# Altium project 2026MM.PrjPcb (part 9 of 10)
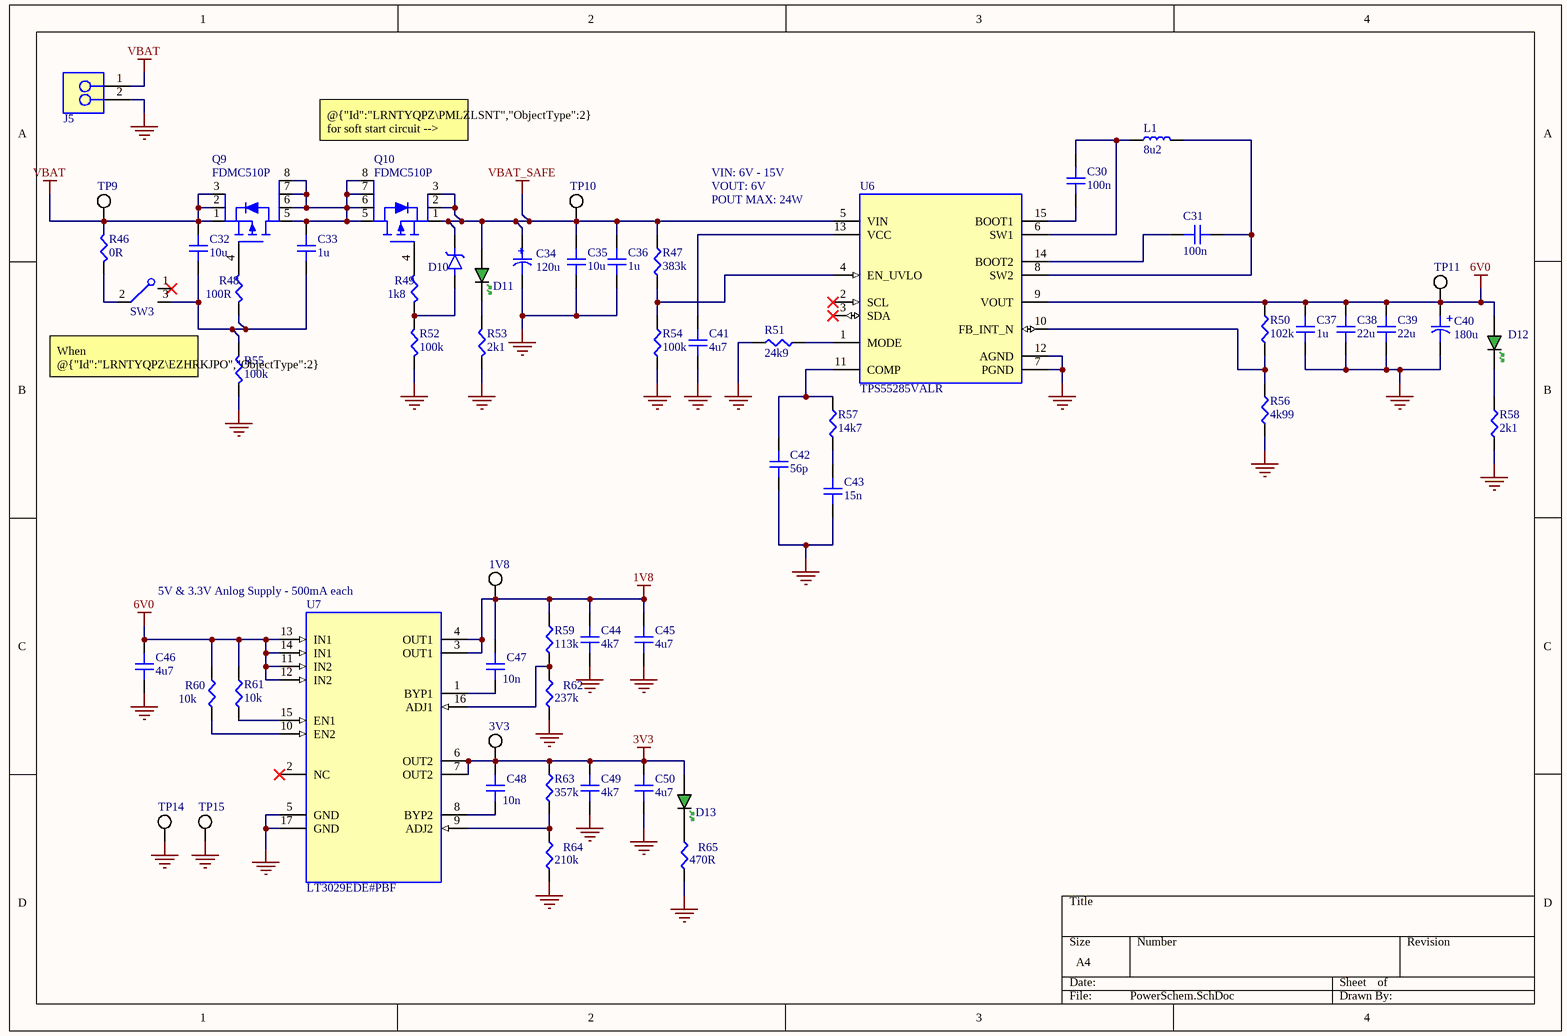
[diagram p9: PowerSchem.SchDoc]

## Sheet PowerSchem.SchDoc (continued)

### Library data of the parts (continued)
R52 = RES: Yageo RC0603FR-07100KL resistor 100k ohm 0603 1% thick film surface mount; Manufacturer: Bourns; Manufacturer Part Number: CR0603-FX-1003ELF; Value: 0; Max Power Dissipation: 100mW; Temperature Coefficient: 100ppm/°C; Voltage Rating: 75V; Voltage Rating (DC): 50V; Supplier: Avnet; Supplier Part Number: 61J5337; RoHS: Compliant; Category: Chip SMD Resistors; Stock: 2610; Pricing: 1=0.1, 25=0.012, 50=0.009, 100=0.006, 500=0.005 (USD); Case/Package: 0603; Case Code (Imperial): 0603; Case Code (Metric): 1608; China RoHS: Non-Compliant; Composition: Thick Film; Contact Plating: Tin; Depth: 800µm; Features: Moisture Resistant; Height: 450µm; Lifecycle Status: Production; Max Operating Temperature: 155°C; Military Standard: Not; Min Operating Temperature: -55°C; Mounting Technology: Surface Mount; Pins: 2; Number of Terminals: 2; Number of Terminations: 2; Packaging: Cut Tape; Power Dissipation: 100mW; Power Rating: 100mW; Radiation Hardening: No; REACH SVHC: Yes; Schedule B: 8533210045, 8533210045|8533210045|8533210045|8533210045|8533210045|8533210045|8533210045|8533210045|8533210045|8533210045|8533210045|8533210045|8533210045|8533210045|8533210045|8533210045|8533210045|8533210045|8533210045|8533210045|8533210045|8533210045|8533210045|85; Termination: SMD/SMT; Tolerance: 1%; Width: 800µm; Working Voltage: 75V; ComponentLink1URL: https://datasheet.octopart.com:443/CR0603-FX-1003ELF-Bourns-datasheet-159578630.pdf?src-supplier=ODG+(Origin+Data+Global); ComponentLink1Description: https://datasheet.octopart.com:443/CR0603-FX-1003ELF-Bourns-datasheet-159578630.pdf?src-supplier=ODG+(Origin+Data+Global); ComponentLink2URL: https://datasheet.octopart.com:443/CR0603-FX-1003ELF-Bourns-datasheet-181955239.pdf?src-supplier=IHS; ComponentLink2Description: https://datasheet.octopart.com:443/CR0603-FX-1003ELF-Bourns-datasheet-181955239.pdf?src-supplier=IHS; ComponentLink3URL: https://datasheet.octopart.com:443/CR0603-FX-1003ELF-Bourns-datasheet-68301634.pdf?src-supplier=Farnell; ComponentLink3Description: https://datasheet.octopart.com:443/CR0603-FX-1003ELF-Bourns-datasheet-68301634.pdf?src-supplier=Farnell; ComponentLink4URL: https://datasheet.octopart.com:443/CR0603-FX-1003ELF-Bourns-datasheet-24895818.pdf?src-supplier=Farnell; ComponentLink4Description: https://datasheet.octopart.com:443/CR0603-FX-1003ELF-Bourns-datasheet-24895818.pdf?src-supplier=Farnell; ComponentLink5URL: https://datasheet.octopart.com:443/CR0603-FX-1003ELF-Bourns-datasheet-22971629.pdf?src-supplier=Farnell; ComponentLink5Description: https://datasheet.octopart.com:443/CR0603-FX-1003ELF-Bourns-datasheet-22971629.pdf?src-supplier=Farnell; ComponentLink6URL: https://datasheet.octopart.com/CR0603-FX-1003ELF-Bourns-datasheet-5318152.pdf; ComponentLink6Description: https://datasheet.octopart.com/CR0603-FX-1003ELF-Bourns-datasheet-5318152.pdf; ComponentLink7URL: https://datasheet.octopart.com:443/CR0603-FX-1003ELF-Bourns-datasheet-154729663.pdf?src-supplier=Electro+Sonic; ComponentLink7Description: https://datasheet.octopart.com:443/CR0603-FX-1003ELF-Bourns-datasheet-154729663.pdf?src-supplier=Electro+Sonic; ComponentLink8URL: https://datasheet.octopart.com:443/CR0603-FX-1003ELF-Bourns-datasheet-34229249.pdf?src-supplier=Electro+Sonic; ComponentLink8Description: https://datasheet.octopart.com:443/CR0603-FX-1003ELF-Bourns-datasheet-34229249.pdf?src-supplier=Electro+Sonic; ComponentLink9URL: https://datasheet.octopart.com:443/CR0603-FX-1003ELF-Bourns-datasheet-11547086.pdf?src-supplier=Electro+Sonic; ComponentLink9Description: https://datasheet.octopart.com:443/CR0603-FX-1003ELF-Bourns-datasheet-11547086.pdf?src-supplier=Electro+Sonic; ComponentLink10URL: https://datasheet.octopart.com:443/CR0603-FX-1003ELF-Bourns-datasheet-49799764.pdf?src-supplier=element14+APAC; ComponentLink10Description: https://datasheet.octopart.com:443/CR0603-FX-1003ELF-Bourns-datasheet-49799764.pdf?src-supplier=element14+APAC; ComponentLink11URL: https://datasheet.octopart.com:443/CR0603-FX-1003ELF.-Bourns-datasheet-62114779.pdf?src-supplier=element14+APAC; ComponentLink11Description: https://datasheet.octopart.com:443/CR0603-FX-1003ELF.-Bourns-datasheet-62114779.pdf?src-supplier=element14+APAC; ComponentLink12URL: https://datasheet.octopart.com:443/CR0603-FX-1003ELF.-Bourns-datasheet-45190937.pdf?src-supplier=element14+APAC; ComponentLink12Description: https://datasheet.octopart.com:443/CR0603-FX-1003ELF.-Bourns-datasheet-45190937.pdf?src-supplier=element14+APAC; ComponentLink13URL: https://datasheet.octopart.com:443/CR0603-FX-1003ELF-Bourns-datasheet-28808732.pdf?src-supplier=element14+APAC; ComponentLink13Description: https://datasheet.octopart.com:443/CR0603-FX-1003ELF-Bourns-datasheet-28808732.pdf?src-supplier=element14+APAC; ComponentLink14URL: https://datasheet.octopart.com:443/CR0603-FX-1003ELF-Bourns-datasheet-140567134.pdf?src-supplier=Arrow.cn; ComponentLink14Description: https://datasheet.octopart.com:443/CR0603-FX-1003ELF-Bourns-datasheet-140567134.pdf?src-supplier=Arrow.cn; ComponentLink15URL: https://datasheet.octopart.com:443/CR0603-FX-1003ELF-Bourns-datasheet-7836176.pdf?src-supplier=Jameco; ComponentLink15Description: https://datasheet.octopart.com:443/CR0603-FX-1003ELF-Bourns-datasheet-7836176.pdf?src-supplier=Jameco; ComponentLink16URL: https://datasheet.octopart.com:443/CR0603-FX-1003ELF-Bourns-datasheet-1361.pdf?src-supplier=Newark; ComponentLink16Description: https://datasheet.octopart.com:443/CR0603-FX-1003ELF-Bourns-datasheet-1361.pdf?src-supplier=Newark; ComponentLink17URL: http://sigma.octopart.com:80/conflict_mineral_statement/Bourns-company-36.pdf?src-supplier=Compliance+Statements; ComponentLink17Description: http://sigma.octopart.com:80/conflict_mineral_statement/Bourns-company-36.pdf?src-supplier=Compliance+Statements; Supplier 1: Avnet; Supplier Part Number 1: RC0603FR-07100KL; Country of Origin: Mainland China, Taiwan; Export Control Classification Number (ECCN) Code: EAR99; Harmonized Tariff Schedule (HTS) Code: 8533.21.00.30; Introduction Date: 2004-09-22; Lead Free: Lead Free; Length: 1.6mm; ComponentLink18URL: https://datasheet.octopart.com:443/RC0603FR-07100KL-Yageo-datasheet-175887523.pdf?src-supplier=Newark; ComponentLink18Description: https://datasheet.octopart.com:443/RC0603FR-07100KL-Yageo-datasheet-175887523.pdf?src-supplier=Newark; ComponentLink19URL: https://datasheet.octopart.com:443/RC0603FR-07100KL-Yageo-datasheet-12596169.pdf?src-supplier=Newark; ComponentLink19Description: https://datasheet.octopart.com:443/RC0603FR-07100KL-Yageo-datasheet-12596169.pdf?src-supplier=Newark; ComponentLink20URL: https://datasheet.octopart.com:443/RC0603FR-07100KL-Yageo-datasheet-34211833.pdf?src-supplier=Newark; ComponentLink20Description: https://datasheet.octopart.com:443/RC0603FR-07100KL-Yageo-datasheet-34211833.pdf?src-supplier=Newark; ComponentLink21URL: https://datasheet.octopart.com:443/RC0603FR-07100KL-Yageo-datasheet-8328172.pdf?src-supplier=element14+APAC; ComponentLink21Description: https://datasheet.octopart.com:443/RC0603FR-07100KL-Yageo-datasheet-8328172.pdf?src-supplier=element14+APAC; ComponentLink22URL: https://datasheet.octopart.com:443/RC0603FR-07100KL-Yageo-datasheet-17842380.pdf?src-supplier=element14+APAC; ComponentLink22Description: https://datasheet.octopart.com:443/RC0603FR-07100KL-Yageo-datasheet-17842380.pdf?src-supplier=element14+APAC; ComponentLink23URL: https://datasheet.octopart.com:443/RC0603FR-07100KL-Yageo-datasheet-141265859.pdf?src-supplier=Upverter; ComponentLink23Description: https://datasheet.octopart.com:443/RC0603FR-07100KL-Yageo-datasheet-141265859.pdf?src-supplier=Upverter; ComponentLink24URL: https://datasheet.octopart.com:443/RC0603FR-07100KL-Yageo-datasheet-103092701.pdf?src-supplier=Upverter; ComponentLink24Description: https://datasheet.octopart.com:443/RC0603FR-07100KL-Yageo-datasheet-103092701.pdf?src-supplier=Upverter; ComponentLink25URL: https://sigma.octopart.com:443/138820526/technical_drawing/Yageo-RC0603FR-07100KL.pdf?src-supplier=Upverter; ComponentLink25Description: https://sigma.octopart.com:443/138820526/technical_drawing/Yageo-RC0603FR-07100KL.pdf?src-supplier=Upverter; ComponentLink26URL: https://datasheet.octopart.com:443/RC0603FR-07100KL-Yageo-datasheet-98239111.pdf?src-supplier=Upverter; ComponentLink26Description: https://datasheet.octopart.com:443/RC0603FR-07100KL-Yageo-datasheet-98239111.pdf?src-supplier=Upverter; ComponentLink27URL: https://datasheet.octopart.com:443/RC0603FR-07100KL-Yageo-datasheet-62067350.pdf?src-supplier=Farnell; ComponentLink27Description: https://datasheet.octopart.com:443/RC0603FR-07100KL-Yageo-datasheet-62067350.pdf?src-supplier=Farnell; ComponentLink28URL: https://datasheet.octopart.com:443/RC0603FR-07100KL-Yageo-datasheet-13691069.pdf?src-supplier=Farnell; ComponentLink28Description: https://datasheet.octopart.com:443/RC0603FR-07100KL-Yageo-datasheet-13691069.pdf?src-supplier=Farnell; ComponentLink29URL: https://datasheet.octopart.com:443/RC0603FR-07100KL-Yageo-Group-datasheet-176638170.pdf?src-supplier=Future+Electronics; ComponentLink29Description: https://datasheet.octopart.com:443/RC0603FR-07100KL-Yageo-Group-datasheet-176638170.pdf?src-supplier=Future+Electronics; ComponentLink30URL: https://datasheet.octopart.com:443/RC0603FR-07100KL-Yageo-datasheet-164759695.pdf?src-supplier=Future+Electronics; ComponentLink30Description: https://datasheet.octopart.com:443/RC0603FR-07100KL-Yageo-datasheet-164759695.pdf?src-supplier=Future+Electronics; ComponentLink31URL: https://datasheet.octopart.com:443/RC0603FR-07100KL-Yageo-datasheet-137700087.pdf?src-supplier=Future+Electronics; ComponentLink31Description: https://datasheet.octopart.com:443/RC0603FR-07100KL-Yageo-datasheet-137700087.pdf?src-supplier=Future+Electronics; ComponentLink32URL: https://datasheet.octopart.com:443/RC0603FR-07100KL-Yageo-datasheet-27584510.pdf?src-supplier=Future+Electronics; ComponentLink32Description: https://datasheet.octopart.com:443/RC0603FR-07100KL-Yageo-datasheet-27584510.pdf?src-supplier=Future+Electronics; ComponentLink33URL: https://datasheet.octopart.com:443/RC0603FR-07100KL-Yageo-datasheet-15599030.pdf?src-supplier=Future+Electronics; ComponentLink33Description: https://datasheet.octopart.com:443/RC0603FR-07100KL-Yageo-datasheet-15599030.pdf?src-supplier=Future+Electronics; ComponentLink34URL: https://datasheet.octopart.com:443/RC0603FR-07100KL-Yageo-datasheet-8324193.pdf?src-supplier=Future+Electronics; ComponentLink34Description: https://datasheet.octopart.com:443/RC0603FR-07100KL-Yageo-datasheet-8324193.pdf?src-supplier=Future+Electronics; ComponentLink35URL: https://datasheet.octopart.com:443/RC0603FR-07100KL-Yageo-datasheet-79472498.pdf?src-supplier=Megastar; ComponentLink35Description: https://datasheet.octopart.com:443/RC0603FR-07100KL-Yageo-datasheet-79472498.pdf?src-supplier=Megastar; ComponentLink36URL: https://datasheet.octopart.com/RC0603FR-07100KL-Yageo-datasheet-73766026.pdf; ComponentLink36Description: https://datasheet.octopart.com/RC0603FR-07100KL-Yageo-datasheet-73766026.pdf; ComponentLink37URL: https://datasheet.octopart.com:443/RC0603FR-07100KL-Yageo-datasheet-30459151.pdf?src-supplier=Seeed+Studio; ComponentLink37Description: https://datasheet.octopart.com:443/RC0603FR-07100KL-Yageo-datasheet-30459151.pdf?src-supplier=Seeed+Studio; ComponentLink38URL: https://datasheet.octopart.com:443/RC0603FR-07100KL-Yageo-datasheet-118562.pdf?src-supplier=DigiKey; ComponentLink38Description: https://datasheet.octopart.com:443/RC0603FR-07100KL-Yageo-datasheet-118562.pdf?src-supplier=DigiKey; ComponentLink39URL: https://datasheet.octopart.com:443/RC0603FR-07100KL-Yageo-datasheet-503470.pdf?src-supplier=element14; ComponentLink39Description: https://datasheet.octopart.com:443/RC0603FR-07100KL-Yageo-datasheet-503470.pdf?src-supplier=element14; ComponentLink40URL: http://sigma.octopart.com:80/conflict_mineral_statement/Yageo-company-3.pdf?src-supplier=Compliance+Statements; ComponentLink40Description: http://sigma.octopart.com:80/conflict_mineral_statement/Yageo-company-3.pdf?src-supplier=Compliance+Statements; ComponentLink41URL: http://sigma.octopart.com:80/rohs_statement/Yageo-company-2.pdf?src-supplier=Compliance+Statements; ComponentLink41Description: http://sigma.octopart.com:80/rohs_statement/Yageo-company-2.pdf?src-supplier=Compliance+Statements
R53 R58 = RES: Res Thick Film 0603 2.1K Ohm 1% 0.1W(1/10W) ±100ppm/C Pad SMD T/R; Manufacturer: Yageo Group; Manufacturer Part Number: RC0603FR-072K1L; Max Power Dissipation: 100mW; Temperature Coefficient: 100ppm/°C; Voltage Rating: 75V; Voltage Rating (DC): 50V; Value: 2k1; Supplier 1: Avnet; Supplier Part Number 1: 49AK1916; RoHS: Compliant; Category: Chip SMD Resistors; Stock: 3524; Pricing: 1=0.103, 25=0.006 (USD); Case/Package: 0603; Case Code (Imperial): 0603; China RoHS: Non-Compliant; Composition: Thick Film; Contact Plating: Tin; Depth: 800µm; Features: Moisture Resistant; Height: 450µm; Lead Free: Lead Free; Length: 1.6mm; Lifecycle Status: Production; Max Operating Temperature: 155°C; Military Standard: Not; Min Operating Temperature: -55°C; Mounting Technology: Surface Mount; Number of Terminals: 2; Number of Terminations: 2; Power Rating: 100mW; Radiation Hardening: No; REACH SVHC: Yes; Schedule B: 8533210045, 8533210045|8533210045, 8533210045|8533210045|8533210045, 8533210045|8533210045|8533210045|8533210045; Termination: SMD/SMT; Tolerance: 1%; Width: 800µm; Working Voltage: 75V; ComponentLink1URL: https://datasheet.octopart.com:443/RC0603FR-072K1L-Yageo-datasheet-175887523.pdf?src-supplier=Newark; ComponentLink1Description: https://datasheet.octopart.com:443/RC0603FR-072K1L-Yageo-datasheet-175887523.pdf?src-supplier=Newark; ComponentLink2URL: https://datasheet.octopart.com:443/RC0603FR-072K1L-Yageo-datasheet-103092701.pdf?src-supplier=Upverter; ComponentLink2Description: https://datasheet.octopart.com:443/RC0603FR-072K1L-Yageo-datasheet-103092701.pdf?src-supplier=Upverter; ComponentLink3URL: https://datasheet.octopart.com:443/RC0603FR-072K1L-Yageo-Group-datasheet-176638170.pdf?src-supplier=Future+Electronics; ComponentLink3Description: https://datasheet.octopart.com:443/RC0603FR-072K1L-Yageo-Group-datasheet-176638170.pdf?src-supplier=Future+Electronics; ComponentLink4URL: https://datasheet.octopart.com:443/RC0603FR-072K1L-Yageo-datasheet-164759695.pdf?src-supplier=Future+Electronics; ComponentLink4Description: https://datasheet.octopart.com:443/RC0603FR-072K1L-Yageo-datasheet-164759695.pdf?src-supplier=Future+Electronics; ComponentLink5URL: https://datasheet.octopart.com:443/RC0603FR-072K1L-Yageo-datasheet-127823281.pdf?src-supplier=Future+Electronics; ComponentLink5Description: https://datasheet.octopart.com:443/RC0603FR-072K1L-Yageo-datasheet-127823281.pdf?src-supplier=Future+Electronics; ComponentLink6URL: https://datasheet.octopart.com:443/RC0603FR-072K1L-Yageo-datasheet-137700087.pdf?src-supplier=Future+Electronics; ComponentLink6Description: https://datasheet.octopart.com:443/RC0603FR-072K1L-Yageo-datasheet-137700087.pdf?src-supplier=Future+Electronics; ComponentLink7URL: https://datasheet.octopart.com:443/RC0603FR-072K1L-Yageo-datasheet-98239111.pdf?src-supplier=Future+Electronics; ComponentLink7Description: https://datasheet.octopart.com:443/RC0603FR-072K1L-Yageo-datasheet-98239111.pdf?src-supplier=Future+Electronics; ComponentLink8URL: https://datasheet.octopart.com:443/RC0603FR-072K1L-Yageo-datasheet-37140709.pdf?src-supplier=Future+Electronics; ComponentLink8Description: https://datasheet.octopart.com:443/RC0603FR-072K1L-Yageo-datasheet-37140709.pdf?src-supplier=Future+Electronics; ComponentLink9URL: https://datasheet.octopart.com:443/RC0603FR-072K1L-Yageo-datasheet-27584510.pdf?src-supplier=Future+Electronics; ComponentLink9Description: https://datasheet.octopart.com:443/RC0603FR-072K1L-Yageo-datasheet-27584510.pdf?src-supplier=Future+Electronics; ComponentLink10URL: https://datasheet.octopart.com:443/RC0603FR-072K1L-Yageo-datasheet-15599030.pdf?src-supplier=Future+Electronics; ComponentLink10Description: https://datasheet.octopart.com:443/RC0603FR-072K1L-Yageo-datasheet-15599030.pdf?src-supplier=Future+Electronics; ComponentLink11URL: https://datasheet.octopart.com:443/RC0603FR-072K1L-Yageo-datasheet-12596169.pdf?src-supplier=Future+Electronics; ComponentLink11Description: https://datasheet.octopart.com:443/RC0603FR-072K1L-Yageo-datasheet-12596169.pdf?src-supplier=Future+Electronics; ComponentLink12URL: https://datasheet.octopart.com:443/RC0603FR-072K1L-Yageo-datasheet-8328172.pdf?src-supplier=Future+Electronics; ComponentLink12Description: https://datasheet.octopart.com:443/RC0603FR-072K1L-Yageo-datasheet-8328172.pdf?src-supplier=Future+Electronics; ComponentLink13URL: https://datasheet.octopart.com:443/RC0603FR-072K1L-Yageo-datasheet-148775077.pdf?src-supplier=TME; ComponentLink13Description: https://datasheet.octopart.com:443/RC0603FR-072K1L-Yageo-datasheet-148775077.pdf?src-supplier=TME; ComponentLink14URL: https://datasheet.octopart.com/RC0603FR-072K1L-Yageo-datasheet-73766026.pdf; ComponentLink14Description: https://datasheet.octopart.com/RC0603FR-072K1L-Yageo-datasheet-73766026.pdf; ComponentLink15URL: https://datasheet.octopart.com:443/RC0603FR-072K1L-Yageo-datasheet-118562.pdf?src-supplier=DigiKey; ComponentLink15Description: https://datasheet.octopart.com:443/RC0603FR-072K1L-Yageo-datasheet-118562.pdf?src-supplier=DigiKey; ComponentLink16URL: http://sigma.octopart.com:80/conflict_mineral_statement/Yageo-company-3.pdf?src-supplier=Compliance+Statements; ComponentLink16Description: http://sigma.octopart.com:80/conflict_mineral_statement/Yageo-company-3.pdf?src-supplier=Compliance+Statements; ComponentLink17URL: http://sigma.octopart.com:80/rohs_statement/Yageo-company-2.pdf?src-supplier=Compliance+Statements; ComponentLink17Description: http://sigma.octopart.com:80/rohs_statement/Yageo-company-2.pdf?src-supplier=Compliance+Statements
R54 R55 = RES: Yageo RC0603FR-07100KL resistor 100k ohm 0603 1% thick film surface mount; Manufacturer: Yageo Group; Power Rating: 100mW; Temperature Coefficient: 100ppm/°C; Voltage Rating: 75V; Voltage Rating (DC): 50V; Value: 100k; Supplier 1: Avnet; Supplier Part Number 1: RC0603FR-07100KL; Manufacturer Part Number: RC0603FR-07100KL; RoHS: Compliant; Category: Chip SMD Resistors; Stock: 550000; Pricing: 5000=0.00136, 10000=0.00132, 20000=0.00129, 40000=0.00126, 80000=0.00123 (USD); Case/Package: 0603; Case Code (Imperial): 0603; Case Code (Metric): 0603; China RoHS: Non-Compliant; Composition: Thick Film; Contact Plating: Tin; Country of Origin: Mainland China, Taiwan; Depth: 800µm; Export Control Classification Number (ECCN) Code: EAR99; Height: 450µm; Harmonized Tariff Schedule (HTS) Code: 8533.21.00.30; Introduction Date: 2004-09-22; Lead Free: Lead Free; Length: 1.6mm; Lifecycle Status: Production; Max Operating Temperature: 155°C; Military Standard: Not; Min Operating Temperature: -55°C; Mounting Technology: Surface Mount; Pins: 2; Number of Terminals: 2; Number of Terminations: 2; Packaging: Tape & Reel; Radiation Hardening: No; REACH SVHC: Yes; Schedule B: 8533210045, 8533210045|8533210045, 8533210045|8533210045|8533210045, 8533210045|8533210045|8533210045|8533210045; Termination: SMD/SMT; Tolerance: 1%; Width: 800µm; Working Voltage: 75V; ComponentLink1URL: https://datasheet.octopart.com:443/RC0603FR-07100KL-Yageo-datasheet-175887523.pdf?src-supplier=Newark; ComponentLink1Description: https://datasheet.octopart.com:443/RC0603FR-07100KL-Yageo-datasheet-175887523.pdf?src-supplier=Newark; ComponentLink2URL: https://datasheet.octopart.com:443/RC0603FR-07100KL-Yageo-datasheet-12596169.pdf?src-supplier=Newark; ComponentLink2Description: https://datasheet.octopart.com:443/RC0603FR-07100KL-Yageo-datasheet-12596169.pdf?src-supplier=Newark; ComponentLink3URL: https://datasheet.octopart.com:443/RC0603FR-07100KL-Yageo-datasheet-34211833.pdf?src-supplier=Newark; ComponentLink3Description: https://datasheet.octopart.com:443/RC0603FR-07100KL-Yageo-datasheet-34211833.pdf?src-supplier=Newark; ComponentLink4URL: https://datasheet.octopart.com:443/RC0603FR-07100KL-Yageo-datasheet-8328172.pdf?src-supplier=element14+APAC; ComponentLink4Description: https://datasheet.octopart.com:443/RC0603FR-07100KL-Yageo-datasheet-8328172.pdf?src-supplier=element14+APAC; ComponentLink5URL: https://datasheet.octopart.com:443/RC0603FR-07100KL-Yageo-datasheet-17842380.pdf?src-supplier=element14+APAC; ComponentLink5Description: https://datasheet.octopart.com:443/RC0603FR-07100KL-Yageo-datasheet-17842380.pdf?src-supplier=element14+APAC; ComponentLink6URL: https://datasheet.octopart.com:443/RC0603FR-07100KL-Yageo-datasheet-141265859.pdf?src-supplier=Upverter; ComponentLink6Description: https://datasheet.octopart.com:443/RC0603FR-07100KL-Yageo-datasheet-141265859.pdf?src-supplier=Upverter; ComponentLink7URL: https://datasheet.octopart.com:443/RC0603FR-07100KL-Yageo-datasheet-103092701.pdf?src-supplier=Upverter; ComponentLink7Description: https://datasheet.octopart.com:443/RC0603FR-07100KL-Yageo-datasheet-103092701.pdf?src-supplier=Upverter; ComponentLink8URL: https://sigma.octopart.com:443/138820526/technical_drawing/Yageo-RC0603FR-07100KL.pdf?src-supplier=Upverter; ComponentLink8Description: https://sigma.octopart.com:443/138820526/technical_drawing/Yageo-RC0603FR-07100KL.pdf?src-supplier=Upverter; ComponentLink9URL: https://datasheet.octopart.com:443/RC0603FR-07100KL-Yageo-datasheet-98239111.pdf?src-supplier=Upverter; ComponentLink9Description: https://datasheet.octopart.com:443/RC0603FR-07100KL-Yageo-datasheet-98239111.pdf?src-supplier=Upverter; ComponentLink10URL: https://datasheet.octopart.com:443/RC0603FR-07100KL-Yageo-datasheet-62067350.pdf?src-supplier=Farnell; ComponentLink10Description: https://datasheet.octopart.com:443/RC0603FR-07100KL-Yageo-datasheet-62067350.pdf?src-supplier=Farnell; ComponentLink11URL: https://datasheet.octopart.com:443/RC0603FR-07100KL-Yageo-datasheet-13691069.pdf?src-supplier=Farnell; ComponentLink11Description: https://datasheet.octopart.com:443/RC0603FR-07100KL-Yageo-datasheet-13691069.pdf?src-supplier=Farnell; ComponentLink12URL: https://datasheet.octopart.com:443/RC0603FR-07100KL-Yageo-Group-datasheet-176638170.pdf?src-supplier=Future+Electronics; ComponentLink12Description: https://datasheet.octopart.com:443/RC0603FR-07100KL-Yageo-Group-datasheet-176638170.pdf?src-supplier=Future+Electronics; ComponentLink13URL: https://datasheet.octopart.com:443/RC0603FR-07100KL-Yageo-datasheet-164759695.pdf?src-supplier=Future+Electronics; ComponentLink13Description: https://datasheet.octopart.com:443/RC0603FR-07100KL-Yageo-datasheet-164759695.pdf?src-supplier=Future+Electronics; ComponentLink14URL: https://datasheet.octopart.com:443/RC0603FR-07100KL-Yageo-datasheet-137700087.pdf?src-supplier=Future+Electronics; ComponentLink14Description: https://datasheet.octopart.com:443/RC0603FR-07100KL-Yageo-datasheet-137700087.pdf?src-supplier=Future+Electronics; ComponentLink15URL: https://datasheet.octopart.com:443/RC0603FR-07100KL-Yageo-datasheet-27584510.pdf?src-supplier=Future+Electronics; ComponentLink15Description: https://datasheet.octopart.com:443/RC0603FR-07100KL-Yageo-datasheet-27584510.pdf?src-supplier=Future+Electronics; ComponentLink16URL: https://datasheet.octopart.com:443/RC0603FR-07100KL-Yageo-datasheet-15599030.pdf?src-supplier=Future+Electronics; ComponentLink16Description: https://datasheet.octopart.com:443/RC0603FR-07100KL-Yageo-datasheet-15599030.pdf?src-supplier=Future+Electronics; ComponentLink17URL: https://datasheet.octopart.com:443/RC0603FR-07100KL-Yageo-datasheet-8324193.pdf?src-supplier=Future+Electronics; ComponentLink17Description: https://datasheet.octopart.com:443/RC0603FR-07100KL-Yageo-datasheet-8324193.pdf?src-supplier=Future+Electronics; ComponentLink18URL: https://datasheet.octopart.com:443/RC0603FR-07100KL-Yageo-datasheet-79472498.pdf?src-supplier=Megastar; ComponentLink18Description: https://datasheet.octopart.com:443/RC0603FR-07100KL-Yageo-datasheet-79472498.pdf?src-supplier=Megastar; ComponentLink19URL: https://datasheet.octopart.com/RC0603FR-07100KL-Yageo-datasheet-73766026.pdf; ComponentLink19Description: https://datasheet.octopart.com/RC0603FR-07100KL-Yageo-datasheet-73766026.pdf; ComponentLink20URL: https://datasheet.octopart.com:443/RC0603FR-07100KL-Yageo-datasheet-30459151.pdf?src-supplier=Seeed+Studio; ComponentLink20Description: https://datasheet.octopart.com:443/RC0603FR-07100KL-Yageo-datasheet-30459151.pdf?src-supplier=Seeed+Studio; ComponentLink21URL: https://datasheet.octopart.com:443/RC0603FR-07100KL-Yageo-datasheet-118562.pdf?src-supplier=DigiKey; ComponentLink21Description: https://datasheet.octopart.com:443/RC0603FR-07100KL-Yageo-datasheet-118562.pdf?src-supplier=DigiKey; ComponentLink22URL: https://datasheet.octopart.com:443/RC0603FR-07100KL-Yageo-datasheet-503470.pdf?src-supplier=element14; ComponentLink22Description: https://datasheet.octopart.com:443/RC0603FR-07100KL-Yageo-datasheet-503470.pdf?src-supplier=element14; ComponentLink23URL: http://sigma.octopart.com:80/conflict_mineral_statement/Yageo-company-3.pdf?src-supplier=Compliance+Statements; ComponentLink23Description: http://sigma.octopart.com:80/conflict_mineral_statement/Yageo-company-3.pdf?src-supplier=Compliance+Statements; ComponentLink24URL: http://sigma.octopart.com:80/rohs_statement/Yageo-company-2.pdf?src-supplier=Compliance+Statements; ComponentLink24Description: http://sigma.octopart.com:80/rohs_statement/Yageo-company-2.pdf?src-supplier=Compliance+Statements
R56 = RES: 100mW Thick Film Resistors 75V ±100ppm/℃ ±1% 4.99kΩ 0603 Chip Resistor - Surface Mount ROHS; Manufacturer: Yageo Group; Manufacturer Part Number: RC0603FR-074K99L; Temperature Coefficient: 100ppm/°C; Voltage Rating (DC): 50V; Value: 4k99; Supplier 1: Avnet; Supplier Part Number 1: RC0603FR-074K99L; RoHS: Compliant; Category: Chip SMD Resistors; Stock: 665000; Pricing: 5000=0.00137, 10000=0.00137, 20000=0.00136, 40000=0.00135, 80000=0.00134 (USD); Case/Package: 0603; Case Code (Imperial): 0603; China RoHS: Non-Compliant; Composition: Thick Film; Contact Plating: Tin; Country of Origin: Mainland China, Taiwan; Depth: 800µm; Export Control Classification Number (ECCN) Code: EAR99; Features: Moisture Resistant; Height: 450µm; Harmonized Tariff Schedule (HTS) Code: 8533.21.00.30; Introduction Date: 2004-09-22; Lead Free: Lead Free; Length: 1.6mm; Lifecycle Status: Production; Max Operating Temperature: 155°C; Max Power Dissipation: 100mW; Military Standard: Not; Min Operating Temperature: -55°C; Mounting Technology: Surface Mount; Pins: 2; Number of Terminals: 2; Number of Terminations: 2; Packaging: Tape & Reel; Power Rating: 100mW; Radiation Hardening: No; REACH SVHC: Yes; Schedule B: 8533210045, 8533210045|8533210045|8533210045|8533210045|8533210045|8533210045|8533210045|8533210045|8533210045|8533210045|8533210045|8533210045|8533210045|8533210045|8533210045|8533210045|8533210045|8533210045|8533210045|8533210045|8533210045|8533210045|8533210045|85; Termination: SMD/SMT; Tolerance: 1%; Voltage Rating: 75V; Weight: 2.012816mg; Width: 800µm; Working Voltage: 75V; ComponentLink1URL: https://datasheet.octopart.com:443/RC0603FR-074K99L-Yageo-datasheet-175887523.pdf?src-supplier=IHS; ComponentLink1Description: https://datasheet.octopart.com:443/RC0603FR-074K99L-Yageo-datasheet-175887523.pdf?src-supplier=IHS; ComponentLink2URL: https://datasheet.octopart.com:443/RC0603FR-074K99L-Yageo-datasheet-8328172.pdf?src-supplier=Newark; ComponentLink2Description: https://datasheet.octopart.com:443/RC0603FR-074K99L-Yageo-datasheet-8328172.pdf?src-supplier=Newark; ComponentLink3URL: https://datasheet.octopart.com:443/RC0603FR-074K99L-Yageo-datasheet-34211833.pdf?src-supplier=Newark; ComponentLink3Description: https://datasheet.octopart.com:443/RC0603FR-074K99L-Yageo-datasheet-34211833.pdf?src-supplier=Newark; ComponentLink4URL: https://datasheet.octopart.com:443/RC0603FR-074K99L-Yageo-datasheet-103092701.pdf?src-supplier=Upverter; ComponentLink4Description: https://datasheet.octopart.com:443/RC0603FR-074K99L-Yageo-datasheet-103092701.pdf?src-supplier=Upverter; ComponentLink5URL: https://datasheet.octopart.com:443/RC0603FR-074K99L-Yageo-datasheet-79472498.pdf?src-supplier=Upverter; ComponentLink5Description: https://datasheet.octopart.com:443/RC0603FR-074K99L-Yageo-datasheet-79472498.pdf?src-supplier=Upverter; ComponentLink6URL: https://datasheet.octopart.com:443/RC0603FR-074K99L-Yageo-datasheet-62067350.pdf?src-supplier=Farnell; ComponentLink6Description: https://datasheet.octopart.com:443/RC0603FR-074K99L-Yageo-datasheet-62067350.pdf?src-supplier=Farnell; ComponentLink7URL: https://datasheet.octopart.com:443/RC0603FR-074K99L-Yageo-Group-datasheet-176638170.pdf?src-supplier=Future+Electronics; ComponentLink7Description: https://datasheet.octopart.com:443/RC0603FR-074K99L-Yageo-Group-datasheet-176638170.pdf?src-supplier=Future+Electronics; ComponentLink8URL: https://datasheet.octopart.com:443/RC0603FR-074K99L-Yageo-datasheet-164759695.pdf?src-supplier=Future+Electronics; ComponentLink8Description: https://datasheet.octopart.com:443/RC0603FR-074K99L-Yageo-datasheet-164759695.pdf?src-supplier=Future+Electronics; ComponentLink9URL: https://datasheet.octopart.com:443/RC0603FR-074K99L-Yageo-datasheet-137700087.pdf?src-supplier=Future+Electronics; ComponentLink9Description: https://datasheet.octopart.com:443/RC0603FR-074K99L-Yageo-datasheet-137700087.pdf?src-supplier=Future+Electronics; ComponentLink10URL: https://datasheet.octopart.com:443/RC0603FR-074K99L-Yageo-datasheet-127823281.pdf?src-supplier=Future+Electronics; ComponentLink10Description: https://datasheet.octopart.com:443/RC0603FR-074K99L-Yageo-datasheet-127823281.pdf?src-supplier=Future+Electronics; ComponentLink11URL: https://datasheet.octopart.com:443/RC0603FR074K99L-Yageo-datasheet-27584510.pdf?src-supplier=Future+Electronics; ComponentLink11Description: https://datasheet.octopart.com:443/RC0603FR074K99L-Yageo-datasheet-27584510.pdf?src-supplier=Future+Electronics; ComponentLink12URL: https://datasheet.octopart.com:443/RC0603FR-074K99L-Yageo-datasheet-15599030.pdf?src-supplier=Future+Electronics; ComponentLink12Description: https://datasheet.octopart.com:443/RC0603FR-074K99L-Yageo-datasheet-15599030.pdf?src-supplier=Future+Electronics; ComponentLink13URL: https://datasheet.octopart.com:443/RC0603FR-074K99L-Yageo-datasheet-12596169.pdf?src-supplier=Future+Electronics; ComponentLink13Description: https://datasheet.octopart.com:443/RC0603FR-074K99L-Yageo-datasheet-12596169.pdf?src-supplier=Future+Electronics; ComponentLink14URL: https://datasheet.octopart.com:443/RC0603FR-074K99L-Yageo-datasheet-503470.pdf?src-supplier=Future+Electronics; ComponentLink14Description: https://datasheet.octopart.com:443/RC0603FR-074K99L-Yageo-datasheet-503470.pdf?src-supplier=Future+Electronics; ComponentLink15URL: https://datasheet.octopart.com/RC0603FR-074K99L-Yageo-datasheet-73766026.pdf; ComponentLink15Description: https://datasheet.octopart.com/RC0603FR-074K99L-Yageo-datasheet-73766026.pdf; ComponentLink16URL: https://datasheet.octopart.com:443/RC0603FR-074K99L-Yageo-datasheet-118562.pdf?src-supplier=DigiKey; ComponentLink16Description: https://datasheet.octopart.com:443/RC0603FR-074K99L-Yageo-datasheet-118562.pdf?src-supplier=DigiKey; ComponentLink17URL: http://sigma.octopart.com:80/conflict_mineral_statement/Yageo-company-3.pdf?src-supplier=Compliance+Statements; ComponentLink17Description: http://sigma.octopart.com:80/conflict_mineral_statement/Yageo-company-3.pdf?src-supplier=Compliance+Statements; ComponentLink18URL: http://sigma.octopart.com:80/rohs_statement/Yageo-company-2.pdf?src-supplier=Compliance+Statements; ComponentLink18Description: http://sigma.octopart.com:80/rohs_statement/Yageo-company-2.pdf?src-supplier=Compliance+Statements
R57 = RES: Res Thick Film 0603 14.7K Ohm 1% 0.1W(1/10W) ±100ppm/C Pad SMD T/R Automotive AEC-Q200; Manufacturer: Stackpole Electronics; Manufacturer Part Number: RMCF0603FT14K7; Max Power Dissipation: 100mW; Temperature Coefficient: 100ppm/°C; Voltage Rating: 75V; Value: 14k7; Supplier 1: Avnet; Supplier Part Number 1: RMCF0603FT14K7; RoHS: Compliant; Category: Chip SMD Resistors; Stock: 170000; Pricing: 5000=0.0019, 10000=0.00188, 20000=0.00185, 40000=0.00182, 80000=0.00179 (USD); Case/Package: 0603; Case Code (Imperial): 0603; Case Code (Metric): 1608; China RoHS: Non-Compliant; Composition: Thick Film; Contact Plating: Tin; Country of Origin: Japan, Mainland China, Taiwan; Export Control Classification Number (ECCN) Code: EAR99; Features: Automotive AEC-Q200; Height: 450µm; Harmonized Tariff Schedule (HTS) Code: 8533.21.00.30; Introduction Date: 2011-01-07; Lead Free: Lead Free; Length: 1.55mm; Lifecycle Status: Production; Max Operating Temperature: 155°C; Min Operating Temperature: -55°C; Mounting Technology: Surface Mount; Number of Terminals: 2; Number of Terminations: 2; Packaging: Cut Tape (CT); Power Rating: 100mW; Radiation Hardening: No; Ratings: AEC-Q200; REACH SVHC: Yes; Schedule B: 8533210045, 8533210045|8533210045|8533210045|8533210045|8533210045; Tolerance: 1%; Width: 800µm; Working Voltage: 75V; ComponentLink1URL: https://datasheet.octopart.com:443/RMCF0603FT14K7-Stackpole-Electronics-datasheet-182148065.pdf?src-supplier=IHS; ComponentLink1Description: https://datasheet.octopart.com:443/RMCF0603FT14K7-Stackpole-Electronics-datasheet-182148065.pdf?src-supplier=IHS; ComponentLink2URL: https://datasheet.octopart.com:443/RMCF0603FT14K7-Stackpole-Electronics-datasheet-28504820.pdf?src-supplier=Upverter; ComponentLink2Description: https://datasheet.octopart.com:443/RMCF0603FT14K7-Stackpole-Electronics-datasheet-28504820.pdf?src-supplier=Upverter; ComponentLink3URL: https://datasheet.octopart.com:443/RMCF0603FT14K7-Stackpole-Electronics-datasheet-141193804.pdf?src-supplier=Master+Electronics; ComponentLink3Description: https://datasheet.octopart.com:443/RMCF0603FT14K7-Stackpole-Electronics-datasheet-141193804.pdf?src-supplier=Master+Electronics; ComponentLink4URL: https://datasheet.octopart.com:443/RMCF0603FT14K7-Stackpole-Electronics-datasheet-189104163.pdf?src-supplier=Master+Electronics; ComponentLink4Description: https://datasheet.octopart.com:443/RMCF0603FT14K7-Stackpole-Electronics-datasheet-189104163.pdf?src-supplier=Master+Electronics; ComponentLink5URL: https://datasheet.octopart.com:443/RMCF0603FT14K7-Stackpole-Electronics-datasheet-116606903.pdf?src-supplier=Master+Electronics; ComponentLink5Description: https://datasheet.octopart.com:443/RMCF0603FT14K7-Stackpole-Electronics-datasheet-116606903.pdf?src-supplier=Master+Electronics; ComponentLink6URL: https://datasheet.octopart.com:443/RMCF0603FT14K7-Stackpole-Electronics-datasheet-62091608.pdf?src-supplier=Stackpole+Electronics; ComponentLink6Description: https://datasheet.octopart.com:443/RMCF0603FT14K7-Stackpole-Electronics-datasheet-62091608.pdf?src-supplier=Stackpole+Electronics; ComponentLink7URL: https://datasheet.octopart.com:443/RMCF0603FT14K7-Stackpole-Electronics-datasheet-12534581.pdf?src-supplier=Stackpole+Electronics; ComponentLink7Description: https://datasheet.octopart.com:443/RMCF0603FT14K7-Stackpole-Electronics-datasheet-12534581.pdf?src-supplier=Stackpole+Electronics; ComponentLink8URL: https://datasheet.octopart.com:443/RMCF0603FT14K7-Stackpole-Electronics-datasheet-10788263.pdf?src-supplier=Stackpole+Electronics; ComponentLink8Description: https://datasheet.octopart.com:443/RMCF0603FT14K7-Stackpole-Electronics-datasheet-10788263.pdf?src-supplier=Stackpole+Electronics; ComponentLink9URL: http://sigma.octopart.com:80/15940719/materials_sheet/Stackpole-Electronics-RMCF0603FT14K7.pdf?src-supplier=Compliance+Statements; ComponentLink9Description: http://sigma.octopart.com:80/15940719/materials_sheet/Stackpole-Electronics-RMCF0603FT14K7.pdf?src-supplier=Compliance+Statements; ComponentLink10URL: http://sigma.octopart.com:80/141158212/rohs_statement/Stackpole-Electronics-RMCF0603FT14K7.pdf?src-supplier=Compliance+Statements; ComponentLink10Description: http://sigma.octopart.com:80/141158212/rohs_statement/Stackpole-Electronics-RMCF0603FT14K7.pdf?src-supplier=Compliance+Statements; ComponentLink11URL: http://sigma.octopart.com:80/141158211/reach_statement/Stackpole-Electronics-RMCF0603FT14K7.pdf?src-supplier=Compliance+Statements; ComponentLink11Description: http://sigma.octopart.com:80/141158211/reach_statement/Stackpole-Electronics-RMCF0603FT14K7.pdf?src-supplier=Compliance+Statements
R59 = RES: 100mW Thick Film Resistors 75V ±100ppm/℃ ±1% 113kΩ 0603 Chip Resistor - Surface Mount ROHS; Manufacturer: Yageo Group; Manufacturer Part Number: RC0603FR-07113KL; Temperature Coefficient: 100ppm/°C; Voltage Rating (DC): 50V; Value: 113k; ComponentLink1URL: https://datasheet.octopart.com:443/CPF0402B200KE1-TE-Connectivity-datasheet-168801553.pdf?src-supplier=Farnell; ComponentLink1Description: https://datasheet.octopart.com:443/CPF0402B200KE1-TE-Connectivity-datasheet-168801553.pdf?src-supplier=Farnell; ComponentLink2URL: https://datasheet.octopart.com:443/CPF0402B200KE1-TE-Connectivity-datasheet-66077623.pdf?src-supplier=Farnell; ComponentLink2Description: https://datasheet.octopart.com:443/CPF0402B200KE1-TE-Connectivity-datasheet-66077623.pdf?src-supplier=Farnell; ComponentLink3URL: https://datasheet.octopart.com:443/CPF0402B200KE1-TE-Connectivity-datasheet-16487054.pdf?src-supplier=Farnell; ComponentLink3Description: https://datasheet.octopart.com:443/CPF0402B200KE1-TE-Connectivity-datasheet-16487054.pdf?src-supplier=Farnell; ComponentLink4URL: https://datasheet.octopart.com:443/CPF0402B200KE1-TE-Connectivity-datasheet-136771900.pdf?src-supplier=Electro+Sonic; ComponentLink4Description: https://datasheet.octopart.com:443/CPF0402B200KE1-TE-Connectivity-datasheet-136771900.pdf?src-supplier=Electro+Sonic; ComponentLink5URL: https://datasheet.octopart.com:443/CPF0402B200KE1-Tyco-Electronics-datasheet-11120060.pdf?src-supplier=Electro+Sonic; ComponentLink5Description: https://datasheet.octopart.com:443/CPF0402B200KE1-Tyco-Electronics-datasheet-11120060.pdf?src-supplier=Electro+Sonic; ComponentLink6URL: https://datasheet.octopart.com:443/CPF0402B200KE1-TE-Connectivity-datasheet-78339038.pdf?src-supplier=Master+Electronics; ComponentLink6Description: https://datasheet.octopart.com:443/CPF0402B200KE1-TE-Connectivity-datasheet-78339038.pdf?src-supplier=Master+Electronics; ComponentLink7URL: https://datasheet.octopart.com:443/CPF0402B200KE1-TE-Connectivity-datasheet-62056503.pdf?src-supplier=Master+Electronics; ComponentLink7Description: https://datasheet.octopart.com:443/CPF0402B200KE1-TE-Connectivity-datasheet-62056503.pdf?src-supplier=Master+Electronics; ComponentLink8URL: https://datasheet.octopart.com:443/CPF0402B200KE1-TE-Connectivity-datasheet-11120284.pdf?src-supplier=Master+Electronics; ComponentLink8Description: https://datasheet.octopart.com:443/CPF0402B200KE1-TE-Connectivity-datasheet-11120284.pdf?src-supplier=Master+Electronics; ComponentLink9URL: https://datasheet.octopart.com:443/3-1879216-5-TE-Connectivity---AMP-datasheet-187588164.pdf?src-supplier=Master+Electronics; ComponentLink9Description: https://datasheet.octopart.com:443/3-1879216-5-TE-Connectivity---AMP-datasheet-187588164.pdf?src-supplier=Master+Electronics; ComponentLink10URL: https://datasheet.octopart.com:443/CPF0402B200KE1-TE-Connectivity-datasheet-17911634.pdf?src-supplier=Master+Electronics; ComponentLink10Description: https://datasheet.octopart.com:443/CPF0402B200KE1-TE-Connectivity-datasheet-17911634.pdf?src-supplier=Master+Electronics; ComponentLink11URL: https://datasheet.octopart.com:443/CPF0402B200KE1-Neohm-datasheet-140860410.pdf?src-supplier=Master+Electronics; ComponentLink11Description: https://datasheet.octopart.com:443/CPF0402B200KE1-Neohm-datasheet-140860410.pdf?src-supplier=Master+Electronics; ComponentLink12URL: https://datasheet.octopart.com:443/CPF0402B200KE1-TE-Connectivity-datasheet-11120073.pdf?src-supplier=TE+Connectivity; ComponentLink12Description: https://datasheet.octopart.com:443/CPF0402B200KE1-TE-Connectivity-datasheet-11120073.pdf?src-supplier=TE+Connectivity; ComponentLink13URL: https://sigma.octopart.com:443/14690934/technical_drawing/TE-Connectivity-CPF0402B200KE1.pdf?src-supplier=TE+Connectivity; ComponentLink13Description: https://sigma.octopart.com:443/14690934/technical_drawing/TE-Connectivity-CPF0402B200KE1.pdf?src-supplier=TE+Connectivity; ComponentLink14URL: https://datasheet.octopart.com:443/CPF0402B200KE1-TE-Connectivity---Neohm-datasheet-165693140.pdf?src-supplier=element14+APAC; ComponentLink14Description: https://datasheet.octopart.com:443/CPF0402B200KE1-TE-Connectivity---Neohm-datasheet-165693140.pdf?src-supplier=element14+APAC; ComponentLink15URL: https://datasheet.octopart.com:443/3-1879216-5-TE-Connectivity-datasheet-158231717.pdf?src-supplier=TME; ComponentLink15Description: https://datasheet.octopart.com:443/3-1879216-5-TE-Connectivity-datasheet-158231717.pdf?src-supplier=TME; ComponentLink16URL: https://datasheet.octopart.com:443/3-1879216-5-TE-Connectivity---AMP-datasheet-21631865.pdf?src-supplier=Future+Electronics; ComponentLink16Description: https://datasheet.octopart.com:443/3-1879216-5-TE-Connectivity---AMP-datasheet-21631865.pdf?src-supplier=Future+Electronics; ComponentLink17URL: http://sigma.octopart.com:80/14831708/rohs_certificate/TE-Connectivity-CPF0402B200KE1.pdf?src-supplier=Compliance+Statements; ComponentLink17Description: http://sigma.octopart.com:80/14831708/rohs_certificate/TE-Connectivity-CPF0402B200KE1.pdf?src-supplier=Compliance+Statements; ComponentLink18URL: http://sigma.octopart.com:80/47028450/materials_sheet/TE-Connectivity-CPF0402B200KE1.pdf?src-supplier=Compliance+Statements; ComponentLink18Description: http://sigma.octopart.com:80/47028450/materials_sheet/TE-Connectivity-CPF0402B200KE1.pdf?src-supplier=Compliance+Statements; Supplier 1: Avnet; Supplier Part Number 1: RC0603FR-07113KL; RoHS: Compliant; Category: Chip SMD Resistors; Stock: 15000; Pricing: 5000=0.00137, 10000=0.00137, 20000=0.00136, 40000=0.00135, 80000=0.00134 (USD); Case/Package: 0603; Case Code (Imperial): 0603; China RoHS: Non-Compliant; Composition: Thick Film; Contact Plating: Lead, Tin; Depth: 800µm; Height: 450µm; Lead Free: Lead Free; Length: 1.6mm; Lifecycle Status: Production; Max Operating Temperature: 155°C; Military Standard: Not; Min Operating Temperature: -55°C; Mounting Technology: Surface Mount; Number of Terminals: 2; Packaging: Tape & Reel; Power Rating: 100mW; Radiation Hardening: No; REACH SVHC: Yes; Schedule B: 8533210045, 8533210045|8533210045, 8533210045|8533210045|8533210045, 8533210045|8533210045|8533210045|8533210045; Termination: SMD/SMT; Tolerance: 1%; Voltage Rating: 75V; Width: 800µm; Working Voltage: 75V; ComponentLink19URL: https://datasheet.octopart.com:443/RC0603FR-07113KL-Yageo-datasheet-175887523.pdf?src-supplier=Newark; ComponentLink19Description: https://datasheet.octopart.com:443/RC0603FR-07113KL-Yageo-datasheet-175887523.pdf?src-supplier=Newark; ComponentLink20URL: https://datasheet.octopart.com:443/RC0603FR-07113KL-Yageo-datasheet-103092701.pdf?src-supplier=Upverter; ComponentLink20Description: https://datasheet.octopart.com:443/RC0603FR-07113KL-Yageo-datasheet-103092701.pdf?src-supplier=Upverter; ComponentLink21URL: https://datasheet.octopart.com:443/RC0603FR-07113KL-Yageo-Group-datasheet-189192902.pdf?src-supplier=TME; ComponentLink21Description: https://datasheet.octopart.com:443/RC0603FR-07113KL-Yageo-Group-datasheet-189192902.pdf?src-supplier=TME; ComponentLink22URL: https://datasheet.octopart.com:443/RC0603FR-07113KL-Yageo-Group-datasheet-176638170.pdf?src-supplier=Future+Electronics; ComponentLink22Description: https://datasheet.octopart.com:443/RC0603FR-07113KL-Yageo-Group-datasheet-176638170.pdf?src-supplier=Future+Electronics; ComponentLink23URL: https://datasheet.octopart.com:443/RC0603FR-07113KL-Yageo-datasheet-164759695.pdf?src-supplier=Future+Electronics; ComponentLink23Description: https://datasheet.octopart.com:443/RC0603FR-07113KL-Yageo-datasheet-164759695.pdf?src-supplier=Future+Electronics; ComponentLink24URL: https://datasheet.octopart.com:443/RC0603FR-07113KL-Yageo-datasheet-137700087.pdf?src-supplier=Future+Electronics; ComponentLink24Description: https://datasheet.octopart.com:443/RC0603FR-07113KL-Yageo-datasheet-137700087.pdf?src-supplier=Future+Electronics; ComponentLink25URL: https://datasheet.octopart.com:443/RC0603FR-07113KL-Yageo-datasheet-15599030.pdf?src-supplier=Future+Electronics; ComponentLink25Description: https://datasheet.octopart.com:443/RC0603FR-07113KL-Yageo-datasheet-15599030.pdf?src-supplier=Future+Electronics; ComponentLink26URL: https://datasheet.octopart.com:443/RC0603FR-07113KL-Yageo-datasheet-12596169.pdf?src-supplier=Future+Electronics; ComponentLink26Description: https://datasheet.octopart.com:443/RC0603FR-07113KL-Yageo-datasheet-12596169.pdf?src-supplier=Future+Electronics; ComponentLink27URL: https://datasheet.octopart.com:443/RC0603FR-07113KL-Yageo-datasheet-8328172.pdf?src-supplier=Future+Electronics; ComponentLink27Description: https://datasheet.octopart.com:443/RC0603FR-07113KL-Yageo-datasheet-8328172.pdf?src-supplier=Future+Electronics; ComponentLink28URL: https://datasheet.octopart.com/RC0603FR-07113KL-Yageo-datasheet-73766026.pdf; ComponentLink28Description: https://datasheet.octopart.com/RC0603FR-07113KL-Yageo-datasheet-73766026.pdf; ComponentLink29URL: https://datasheet.octopart.com:443/RC0603FR-07113KL-Yageo-datasheet-118562.pdf?src-supplier=DigiKey; ComponentLink29Description: https://datasheet.octopart.com:443/RC0603FR-07113KL-Yageo-datasheet-118562.pdf?src-supplier=DigiKey; ComponentLink30URL: http://sigma.octopart.com:80/conflict_mineral_statement/Yageo-company-3.pdf?src-supplier=Compliance+Statements; ComponentLink30Description: http://sigma.octopart.com:80/conflict_mineral_statement/Yageo-company-3.pdf?src-supplier=Compliance+Statements; ComponentLink31URL: http://sigma.octopart.com:80/rohs_statement/Yageo-company-2.pdf?src-supplier=Compliance+Statements; ComponentLink31Description: http://sigma.octopart.com:80/rohs_statement/Yageo-company-2.pdf?src-supplier=Compliance+Statements